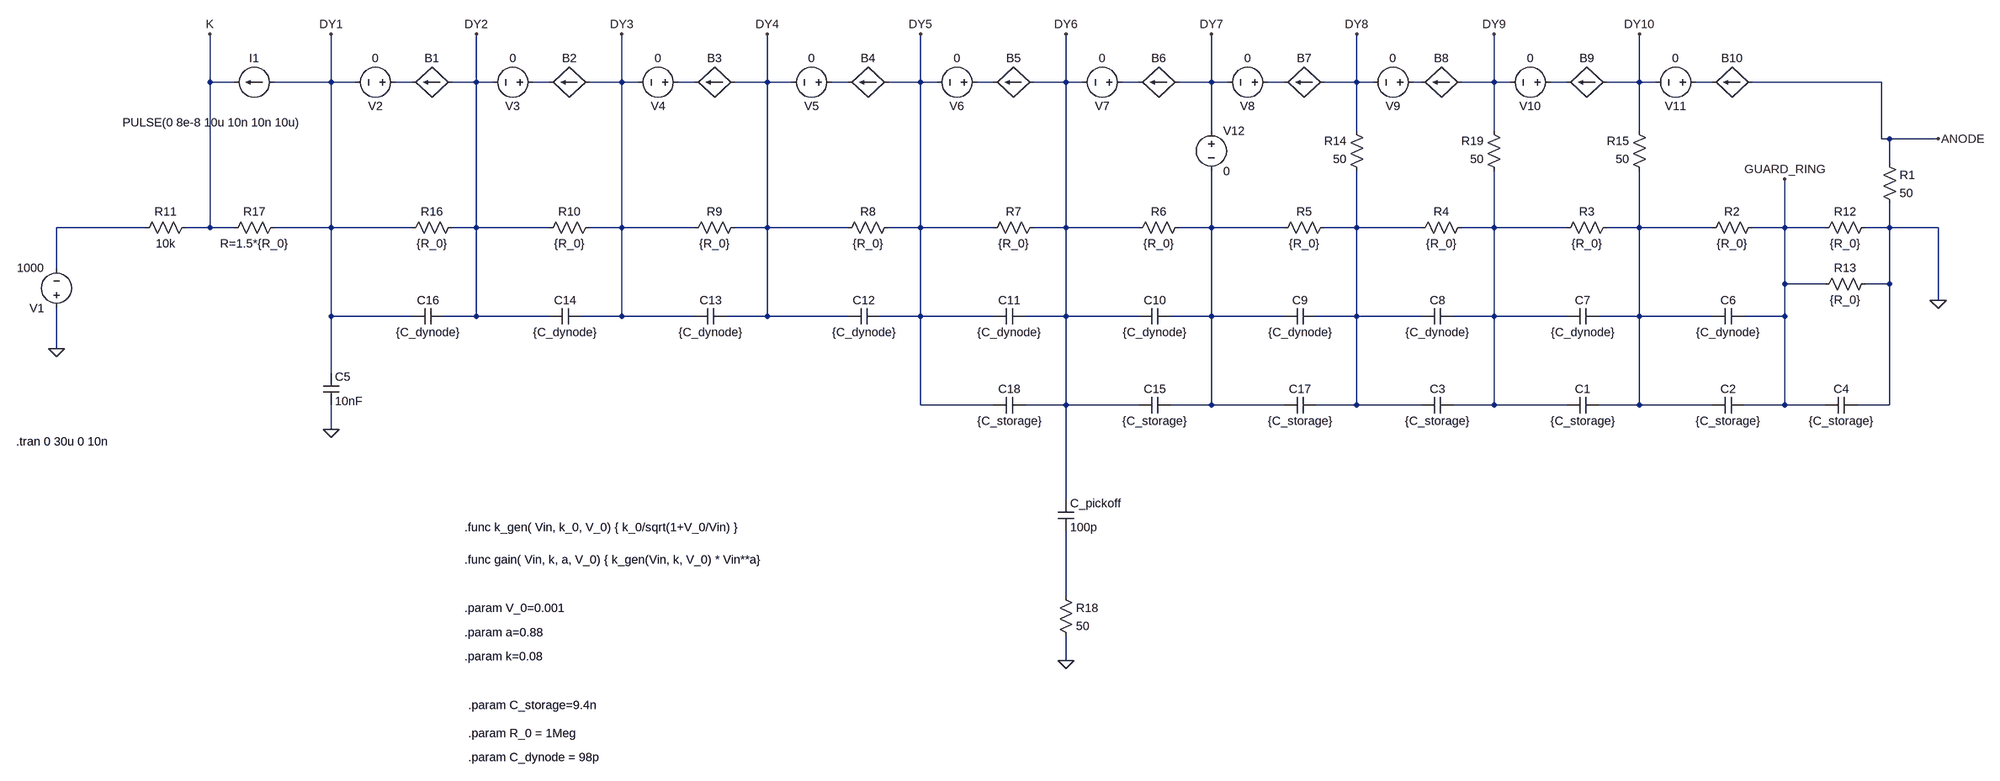
[diagram p0: schematic R12699 model - power law.asc]
R12699 model - power law.asc, the LTspice schematic file:
Version 4.1
SHEET 1 1988 1012
WIRE -2464 -544 -2464 -640
WIRE -2416 -544 -2464 -544
WIRE -2224 -544 -2224 -640
WIRE -2224 -544 -2336 -544
WIRE -2176 -544 -2224 -544
WIRE -2064 -544 -2096 -544
WIRE -1936 -544 -1936 -640
WIRE -1936 -544 -1984 -544
WIRE -1904 -544 -1936 -544
WIRE -1792 -544 -1824 -544
WIRE -1648 -544 -1648 -640
WIRE -1648 -544 -1712 -544
WIRE -1616 -544 -1648 -544
WIRE -1504 -544 -1536 -544
WIRE -1360 -544 -1360 -640
WIRE -1360 -544 -1424 -544
WIRE -1312 -544 -1360 -544
WIRE -1200 -544 -1232 -544
WIRE -1056 -544 -1056 -640
WIRE -1056 -544 -1120 -544
WIRE -1024 -544 -1056 -544
WIRE -912 -544 -944 -544
WIRE -768 -544 -768 -640
WIRE -768 -544 -832 -544
WIRE -736 -544 -768 -544
WIRE -624 -544 -656 -544
WIRE -480 -544 -480 -640
WIRE -480 -544 -544 -544
WIRE -448 -544 -480 -544
WIRE -336 -544 -368 -544
WIRE -192 -544 -192 -640
WIRE -192 -544 -256 -544
WIRE -160 -544 -192 -544
WIRE -64 -544 -80 -544
WIRE 80 -544 80 -640
WIRE 80 -544 16 -544
WIRE 112 -544 80 -544
WIRE 224 -544 192 -544
WIRE 368 -544 368 -640
WIRE 368 -544 304 -544
WIRE 400 -544 368 -544
WIRE 512 -544 480 -544
WIRE 848 -544 592 -544
WIRE -480 -448 -480 -544
WIRE -192 -448 -192 -544
WIRE 80 -448 80 -544
WIRE 368 -448 368 -544
WIRE 848 -432 848 -544
WIRE 864 -432 848 -432
WIRE 960 -432 864 -432
WIRE 864 -384 864 -432
WIRE -2592 -256 -2768 -256
WIRE -2464 -256 -2464 -544
WIRE -2464 -256 -2512 -256
WIRE -2416 -256 -2464 -256
WIRE -2224 -256 -2224 -544
WIRE -2224 -256 -2336 -256
WIRE -2064 -256 -2224 -256
WIRE -1936 -256 -1936 -544
WIRE -1936 -256 -1984 -256
WIRE -1792 -256 -1936 -256
WIRE -1648 -256 -1648 -544
WIRE -1648 -256 -1712 -256
WIRE -1504 -256 -1648 -256
WIRE -1360 -256 -1360 -544
WIRE -1360 -256 -1424 -256
WIRE -1200 -256 -1360 -256
WIRE -1056 -256 -1056 -544
WIRE -1056 -256 -1120 -256
WIRE -912 -256 -1056 -256
WIRE -768 -256 -768 -544
WIRE -768 -256 -832 -256
WIRE -624 -256 -768 -256
WIRE -480 -256 -480 -368
WIRE -480 -256 -544 -256
WIRE -336 -256 -480 -256
WIRE -192 -256 -192 -368
WIRE -192 -256 -256 -256
WIRE -64 -256 -192 -256
WIRE 80 -256 80 -368
WIRE 80 -256 16 -256
WIRE 224 -256 80 -256
WIRE 368 -256 368 -368
WIRE 368 -256 304 -256
WIRE 512 -256 368 -256
WIRE 656 -256 656 -352
WIRE 656 -256 592 -256
WIRE 736 -256 656 -256
WIRE 864 -256 864 -304
WIRE 864 -256 816 -256
WIRE 960 -256 864 -256
WIRE -2768 -176 -2768 -256
WIRE 656 -144 656 -256
WIRE 736 -144 656 -144
WIRE 864 -144 864 -256
WIRE 864 -144 816 -144
WIRE 960 -112 960 -256
WIRE -2224 -80 -2224 -256
WIRE -2064 -80 -2224 -80
WIRE -1936 -80 -1936 -256
WIRE -1936 -80 -2000 -80
WIRE -1792 -80 -1936 -80
WIRE -1648 -80 -1648 -256
WIRE -1648 -80 -1728 -80
WIRE -1504 -80 -1648 -80
WIRE -1360 -80 -1360 -256
WIRE -1360 -80 -1440 -80
WIRE -1200 -80 -1360 -80
WIRE -1056 -80 -1056 -256
WIRE -1056 -80 -1136 -80
WIRE -912 -80 -1056 -80
WIRE -768 -80 -768 -256
WIRE -768 -80 -848 -80
WIRE -624 -80 -768 -80
WIRE -480 -80 -480 -256
WIRE -480 -80 -560 -80
WIRE -336 -80 -480 -80
WIRE -192 -80 -192 -256
WIRE -192 -80 -272 -80
WIRE -64 -80 -192 -80
WIRE 80 -80 80 -256
WIRE 80 -80 0 -80
WIRE 224 -80 80 -80
WIRE 368 -80 368 -256
WIRE 368 -80 288 -80
WIRE 512 -80 368 -80
WIRE 656 -80 656 -144
WIRE 656 -80 576 -80
WIRE -2768 -16 -2768 -96
WIRE -2224 32 -2224 -80
WIRE -1056 96 -1056 -80
WIRE -912 96 -1056 96
WIRE -768 96 -768 -80
WIRE -768 96 -848 96
WIRE -624 96 -768 96
WIRE -480 96 -480 -80
WIRE -480 96 -560 96
WIRE -336 96 -480 96
WIRE -192 96 -192 -80
WIRE -192 96 -272 96
WIRE -64 96 -192 96
WIRE 80 96 80 -80
WIRE 80 96 0 96
WIRE 224 96 80 96
WIRE 368 96 368 -80
WIRE 368 96 288 96
WIRE 512 96 368 96
WIRE 656 96 656 -80
WIRE 656 96 576 96
WIRE 736 96 656 96
WIRE 864 96 864 -144
WIRE 864 96 800 96
WIRE -2224 144 -2224 96
WIRE -768 384 -768 96
WIRE -768 576 -768 448
WIRE -768 704 -768 656
FLAG -2224 144 0
FLAG 960 -112 0
FLAG -2768 -16 0
FLAG -2224 -640 DY1
FLAG -1936 -640 DY2
FLAG -1648 -640 DY3
FLAG -1360 -640 DY4
FLAG -1056 -640 DY5
FLAG -768 -640 DY6
FLAG -480 -640 DY7
FLAG -192 -640 DY8
FLAG 80 -640 DY9
FLAG 368 -640 DY10
FLAG 656 -352 GUARD_RING
FLAG -768 704 0
FLAG -2464 -640 K
FLAG 960 -432 ANODE
SYMBOL cap 288 80 R90
WINDOW 0 0 32 VBottom 2
WINDOW 3 32 32 VTop 2
SYMATTR InstName C1
SYMATTR Value {C_storage}
SYMBOL cap 576 80 R90
WINDOW 0 0 32 VBottom 2
WINDOW 3 32 32 VTop 2
SYMATTR InstName C2
SYMATTR Value {C_storage}
SYMBOL cap 0 80 R90
WINDOW 0 0 32 VBottom 2
WINDOW 3 32 32 VTop 2
SYMATTR InstName C3
SYMATTR Value {C_storage}
SYMBOL cap 800 80 R90
WINDOW 0 0 32 VBottom 2
WINDOW 3 32 32 VTop 2
SYMATTR InstName C4
SYMATTR Value {C_storage}
SYMBOL cap -2240 32 R0
SYMATTR InstName C5
SYMATTR Value 10nF
SYMBOL cap 576 -96 R90
WINDOW 0 0 32 VBottom 2
WINDOW 3 32 32 VTop 2
SYMATTR InstName C6
SYMATTR Value {C_dynode}
SYMBOL res 608 -272 R90
WINDOW 0 0 56 VBottom 2
WINDOW 3 32 56 VTop 2
SYMATTR InstName R2
SYMATTR Value {R_0}
SYMBOL cap 288 -96 R90
WINDOW 0 0 32 VBottom 2
WINDOW 3 32 32 VTop 2
SYMATTR InstName C7
SYMATTR Value {C_dynode}
SYMBOL res 320 -272 R90
WINDOW 0 0 56 VBottom 2
WINDOW 3 32 56 VTop 2
SYMATTR InstName R3
SYMATTR Value {R_0}
SYMBOL cap 0 -96 R90
WINDOW 0 0 32 VBottom 2
WINDOW 3 32 32 VTop 2
SYMATTR InstName C8
SYMATTR Value {C_dynode}
SYMBOL res 32 -272 R90
WINDOW 0 0 56 VBottom 2
WINDOW 3 32 56 VTop 2
SYMATTR InstName R4
SYMATTR Value {R_0}
SYMBOL cap -272 -96 R90
WINDOW 0 0 32 VBottom 2
WINDOW 3 32 32 VTop 2
SYMATTR InstName C9
SYMATTR Value {C_dynode}
SYMBOL res -240 -272 R90
WINDOW 0 0 56 VBottom 2
WINDOW 3 32 56 VTop 2
SYMATTR InstName R5
SYMATTR Value {R_0}
SYMBOL cap -560 -96 R90
WINDOW 0 0 32 VBottom 2
WINDOW 3 32 32 VTop 2
SYMATTR InstName C10
SYMATTR Value {C_dynode}
SYMBOL res -528 -272 R90
WINDOW 0 0 56 VBottom 2
WINDOW 3 32 56 VTop 2
SYMATTR InstName R6
SYMATTR Value {R_0}
SYMBOL cap -848 -96 R90
WINDOW 0 0 32 VBottom 2
WINDOW 3 32 32 VTop 2
SYMATTR InstName C11
SYMATTR Value {C_dynode}
SYMBOL res -816 -272 R90
WINDOW 0 0 56 VBottom 2
WINDOW 3 32 56 VTop 2
SYMATTR InstName R7
SYMATTR Value {R_0}
SYMBOL cap -1136 -96 R90
WINDOW 0 0 32 VBottom 2
WINDOW 3 32 32 VTop 2
SYMATTR InstName C12
SYMATTR Value {C_dynode}
SYMBOL res -1104 -272 R90
WINDOW 0 0 56 VBottom 2
WINDOW 3 32 56 VTop 2
SYMATTR InstName R8
SYMATTR Value {R_0}
SYMBOL cap -1440 -96 R90
WINDOW 0 0 32 VBottom 2
WINDOW 3 32 32 VTop 2
SYMATTR InstName C13
SYMATTR Value {C_dynode}
SYMBOL res -1408 -272 R90
WINDOW 0 0 56 VBottom 2
WINDOW 3 32 56 VTop 2
SYMATTR InstName R9
SYMATTR Value {R_0}
SYMBOL cap -1728 -96 R90
WINDOW 0 0 32 VBottom 2
WINDOW 3 32 32 VTop 2
SYMATTR InstName C14
SYMATTR Value {C_dynode}
SYMBOL res -1696 -272 R90
WINDOW 0 0 56 VBottom 2
WINDOW 3 32 56 VTop 2
SYMATTR InstName R10
SYMATTR Value {R_0}
SYMBOL res -2496 -272 R90
WINDOW 0 0 56 VBottom 2
WINDOW 3 32 56 VTop 2
SYMATTR InstName R11
SYMATTR Value 10k
SYMBOL res 832 -272 R90
WINDOW 0 0 56 VBottom 2
WINDOW 3 32 56 VTop 2
SYMATTR InstName R12
SYMATTR Value {R_0}
SYMBOL res 832 -160 R90
WINDOW 0 0 56 VBottom 2
WINDOW 3 32 56 VTop 2
SYMATTR InstName R13
SYMATTR Value {R_0}
SYMBOL res 384 -352 R180
WINDOW 0 36 76 Left 2
WINDOW 3 36 40 Left 2
SYMATTR InstName R15
SYMATTR Value 50
SYMBOL cap -2000 -96 R90
WINDOW 0 0 32 VBottom 2
WINDOW 3 32 32 VTop 2
SYMATTR InstName C16
SYMATTR Value {C_dynode}
SYMBOL res -1968 -272 R90
WINDOW 0 0 56 VBottom 2
WINDOW 3 32 56 VTop 2
SYMATTR InstName R16
SYMATTR Value {R_0}
SYMBOL bi -1984 -544 R90
WINDOW 0 -32 40 VBottom 2
WINDOW 3 32 40 Invisible 2
SYMATTR InstName B1
SYMATTR Value I=I(I1) * gain( V( DY2,DY1), k, a, V_0 )
SYMBOL bi -1712 -544 R90
WINDOW 0 -32 40 VBottom 2
WINDOW 3 32 40 Invisible 2
SYMATTR InstName B2
SYMATTR Value I=I(V2) * gain( V( DY3, DY2), k, a, V_0 )
SYMBOL bi -1424 -544 R90
WINDOW 0 -32 40 VBottom 2
WINDOW 3 32 40 Invisible 2
SYMATTR InstName B3
SYMATTR Value I=I(V3) * gain( V( DY4, DY3), k, a, V_0 )
SYMBOL current -2336 -544 R90
WINDOW 0 -32 40 VBottom 2
WINDOW 3 64 125 VTop 2
WINDOW 123 0 0 Left 0
WINDOW 39 0 0 Left 0
SYMATTR InstName I1
SYMATTR Value PULSE(0 8e-8 10u 10n 10n 10u)
SYMBOL bi -1120 -544 R90
WINDOW 0 -32 40 VBottom 2
WINDOW 3 32 40 Invisible 2
SYMATTR InstName B4
SYMATTR Value I=I(V4) * gain( V( DY5, DY4), k, a, V_0 )
SYMBOL bi -832 -544 R90
WINDOW 0 -32 40 VBottom 2
WINDOW 3 32 40 Invisible 2
SYMATTR InstName B5
SYMATTR Value I=I(V5) * gain( V( DY6, DY5), k, a, V_0 )
SYMBOL bi -544 -544 R90
WINDOW 0 -32 40 VBottom 2
WINDOW 3 32 40 Invisible 2
SYMATTR InstName B6
SYMATTR Value I=I(V6) * gain( V( DY7, DY6), k, a, V_0 )
SYMBOL bi -256 -544 R90
WINDOW 0 -32 40 VBottom 2
WINDOW 3 32 40 Invisible 2
SYMATTR InstName B7
SYMATTR Value I=I(V7) * gain( V( DY8, DY7), k, a, V_0 )
SYMBOL bi 16 -544 R90
WINDOW 0 -32 40 VBottom 2
WINDOW 3 32 40 Invisible 2
SYMATTR InstName B8
SYMATTR Value I=I(V8) * gain( V( DY9, DY8), k, a, V_0 )
SYMBOL bi 304 -544 R90
WINDOW 0 -32 40 VBottom 2
WINDOW 3 32 40 Invisible 2
SYMATTR InstName B9
SYMATTR Value I=I(V9) * gain( V( DY10, DY9), k, a, V_0 )
SYMBOL bi 592 -544 R90
WINDOW 0 -32 40 VBottom 2
WINDOW 3 32 40 Invisible 2
SYMATTR InstName B10
SYMATTR Value I=I(V10) * gain( V(ANODE,DY10), k, a, V_0 )
SYMBOL res -2320 -272 R90
WINDOW 0 0 56 VBottom 2
WINDOW 3 32 56 VTop 2
SYMATTR InstName R17
SYMATTR Value R=1.5*{R_0}
SYMBOL voltage -2768 -80 R180
WINDOW 123 0 0 Left 0
WINDOW 39 0 0 Left 0
SYMATTR InstName V1
SYMATTR Value 1000
SYMBOL voltage -2080 -544 R90
WINDOW 0 32 56 VTop 2
WINDOW 3 -32 56 VBottom 2
WINDOW 123 0 0 Left 0
WINDOW 39 4 56 VTop 2
SYMATTR InstName V2
SYMATTR Value 0
SYMBOL voltage -1808 -544 R90
WINDOW 0 32 56 VTop 2
WINDOW 3 -32 56 VBottom 2
WINDOW 123 0 0 Left 0
WINDOW 39 4 56 VTop 2
SYMATTR InstName V3
SYMATTR Value 0
SYMBOL voltage -1520 -544 R90
WINDOW 0 32 56 VTop 2
WINDOW 3 -32 56 VBottom 2
WINDOW 123 0 0 Left 0
WINDOW 39 4 56 VTop 2
SYMATTR InstName V4
SYMATTR Value 0
SYMBOL voltage -1216 -544 R90
WINDOW 0 32 56 VTop 2
WINDOW 3 -32 56 VBottom 2
WINDOW 123 0 0 Left 0
WINDOW 39 4 56 VTop 2
SYMATTR InstName V5
SYMATTR Value 0
SYMBOL voltage -928 -544 R90
WINDOW 0 32 56 VTop 2
WINDOW 3 -32 56 VBottom 2
WINDOW 123 0 0 Left 0
WINDOW 39 4 56 VTop 2
SYMATTR InstName V6
SYMATTR Value 0
SYMBOL voltage -640 -544 R90
WINDOW 0 32 56 VTop 2
WINDOW 3 -32 56 VBottom 2
WINDOW 123 0 0 Left 0
WINDOW 39 4 56 VTop 2
SYMATTR InstName V7
SYMATTR Value 0
SYMBOL voltage -352 -544 R90
WINDOW 0 32 56 VTop 2
WINDOW 3 -32 56 VBottom 2
WINDOW 123 0 0 Left 0
WINDOW 39 4 56 VTop 2
SYMATTR InstName V8
SYMATTR Value 0
SYMBOL voltage -64 -544 R90
WINDOW 0 32 56 VTop 2
WINDOW 3 -32 56 VBottom 2
WINDOW 123 0 0 Left 0
WINDOW 39 4 56 VTop 2
SYMATTR InstName V9
SYMATTR Value 0
SYMBOL voltage 208 -544 R90
WINDOW 0 32 56 VTop 2
WINDOW 3 -32 56 VBottom 2
WINDOW 123 0 0 Left 0
WINDOW 39 4 56 VTop 2
SYMATTR InstName V10
SYMATTR Value 0
SYMBOL voltage 496 -544 R90
WINDOW 0 32 56 VTop 2
WINDOW 3 -32 56 VBottom 2
WINDOW 123 0 0 Left 0
WINDOW 39 4 56 VTop 2
SYMATTR InstName V11
SYMATTR Value 0
SYMBOL cap -784 384 R0
SYMATTR InstName C_pickoff
SYMATTR Value 100p
SYMBOL res -784 560 R0
SYMATTR InstName R18
SYMATTR Value 50
SYMBOL res 848 -400 R0
SYMATTR InstName R1
SYMATTR Value 50
SYMBOL res -176 -352 R180
WINDOW 0 36 76 Left 2
WINDOW 3 36 40 Left 2
SYMATTR InstName R14
SYMATTR Value 50
SYMBOL res 96 -352 R180
WINDOW 0 36 76 Left 2
WINDOW 3 36 40 Left 2
SYMATTR InstName R19
SYMATTR Value 50
SYMBOL voltage -480 -464 R0
WINDOW 123 0 0 Left 0
WINDOW 39 0 0 Left 0
SYMATTR InstName V12
SYMATTR Value 0
SYMBOL cap -560 80 R90
WINDOW 0 0 32 VBottom 2
WINDOW 3 32 32 VTop 2
SYMATTR InstName C15
SYMATTR Value {C_storage}
SYMBOL cap -272 80 R90
WINDOW 0 0 32 VBottom 2
WINDOW 3 32 32 VTop 2
SYMATTR InstName C17
SYMATTR Value {C_storage}
SYMBOL cap -848 80 R90
WINDOW 0 0 32 VBottom 2
WINDOW 3 32 32 VTop 2
SYMATTR InstName C18
SYMATTR Value {C_storage}
TEXT -2848 168 Left 2 !.tran 0 30u 0 10n
TEXT -1960 440 Left 2 !.func k_gen( Vin, k_0, V_0) { k_0/sqrt(1+V_0/Vin) }
TEXT -1960 504 Left 2 !.func gain( Vin, k, a, V_0) { k_gen(Vin, k, V_0) * Vin**a}
TEXT -1960 600 Left 2 !.param V_0=0.001
TEXT -1960 648 Left 2 !.param a=0.88
TEXT -1960 696 Left 2 !.param k=0.08
TEXT -1952 792 Left 2 !.param C_storage=9.4n
TEXT -1952 848 Left 2 !.param R_0 = 1Meg
TEXT -1952 896 Left 2 !.param C_dynode = 98p

The netlist it stands for:
* R12699 model - power law.asc
C1 N015 N014 {C_storage}
C2 GUARD_RING N015 {C_storage}
C3 N014 N013 {C_storage}
C4 0 GUARD_RING {C_storage}
C5 DY1 0 10nF
C6 GUARD_RING N015 {C_dynode}
R2 GUARD_RING N015 {R_0}
C7 N015 N014 {C_dynode}
R3 N015 N014 {R_0}
C8 N014 N013 {C_dynode}
R4 N014 N013 {R_0}
C9 N013 N012 {C_dynode}
R5 N013 N012 {R_0}
C10 N012 DY6 {C_dynode}
R6 N012 DY6 {R_0}
C11 DY6 DY5 {C_dynode}
R7 DY6 DY5 {R_0}
C12 DY5 DY4 {C_dynode}
R8 DY5 DY4 {R_0}
C13 DY4 DY3 {C_dynode}
R9 DY4 DY3 {R_0}
C14 DY3 DY2 {C_dynode}
R10 DY3 DY2 {R_0}
R11 K N011 10k
R12 0 GUARD_RING {R_0}
R13 0 GUARD_RING {R_0}
R15 N015 DY10 50
C16 DY2 DY1 {C_dynode}
R16 DY2 DY1 {R_0}
B1 DY2 N001 I=I(I1) * gain( V( DY2,DY1), k, a, V_0 )
B2 DY3 N002 I=I(V2) * gain( V( DY3, DY2), k, a, V_0 )
B3 DY4 N003 I=I(V3) * gain( V( DY4, DY3), k, a, V_0 )
I1 DY1 K PULSE(0 8e-8 10u 10n 10n 10u)
B4 DY5 N004 I=I(V4) * gain( V( DY5, DY4), k, a, V_0 )
B5 DY6 N005 I=I(V5) * gain( V( DY6, DY5), k, a, V_0 )
B6 DY7 N006 I=I(V6) * gain( V( DY7, DY6), k, a, V_0 )
B7 DY8 N007 I=I(V7) * gain( V( DY8, DY7), k, a, V_0 )
B8 DY9 N008 I=I(V8) * gain( V( DY9, DY8), k, a, V_0 )
B9 DY10 N009 I=I(V9) * gain( V( DY10, DY9), k, a, V_0 )
B10 ANODE N010 I=I(V10) * gain( V(ANODE,DY10), k, a, V_0 )
R17 DY1 K R=1.5*{R_0}
V1 0 N011 1000
V2 N001 DY1 0
V3 N002 DY2 0
V4 N003 DY3 0
V5 N004 DY4 0
V6 N005 DY5 0
V7 N006 DY6 0
V8 N007 DY7 0
V9 N008 DY8 0
V10 N009 DY9 0
V11 N010 DY10 0
C_pickoff DY6 N016 100p
R18 N016 0 50
R1 ANODE 0 50
R14 N013 DY8 50
R19 N014 DY9 50
V12 DY7 N012 0
C15 N012 DY6 {C_storage}
C17 N013 N012 {C_storage}
C18 DY6 DY5 {C_storage}
.tran 0 30u 0 10n
.func k_gen( Vin, k_0, V_0) { k_0/sqrt(1+V_0/Vin) }
.func gain( Vin, k, a, V_0) { k_gen(Vin, k, V_0) * Vin**a}
.param V_0=0.001
.param a=0.88
.param k=0.08
.param C_storage=9.4n
.param R_0 = 1Meg
.param C_dynode = 98p
.backanno
.end